# EAGLE design Stromcek v1.0 (EAGLE 9.6.2)
CNAME: Solder paste dispenser; DESIGNER: Miroslav Pivovarsky
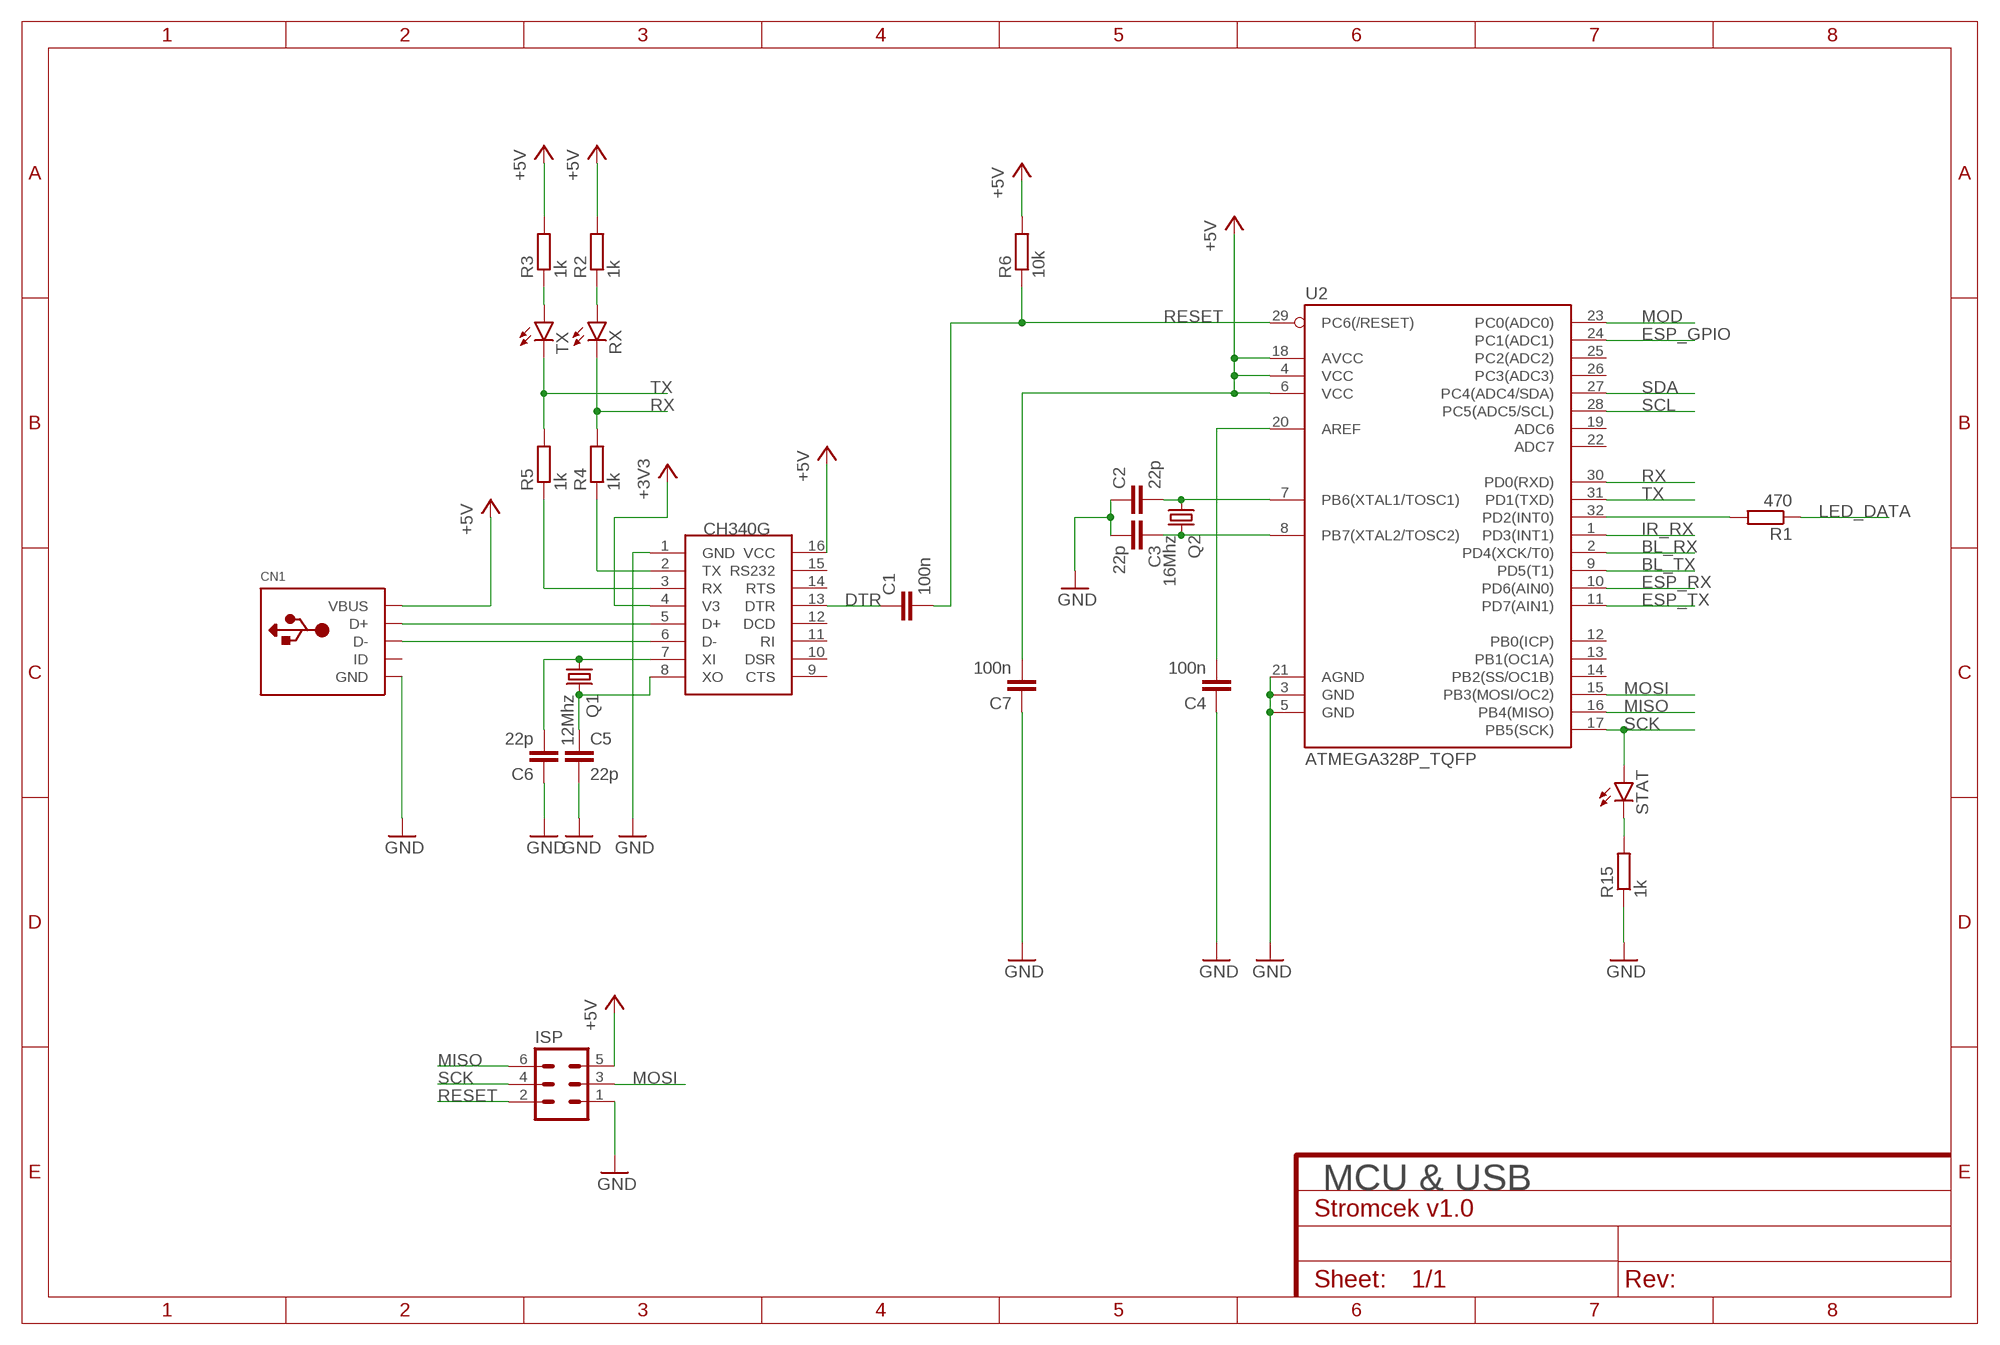
[diagram p0: schematic, sheet 1, part 1 of 2]
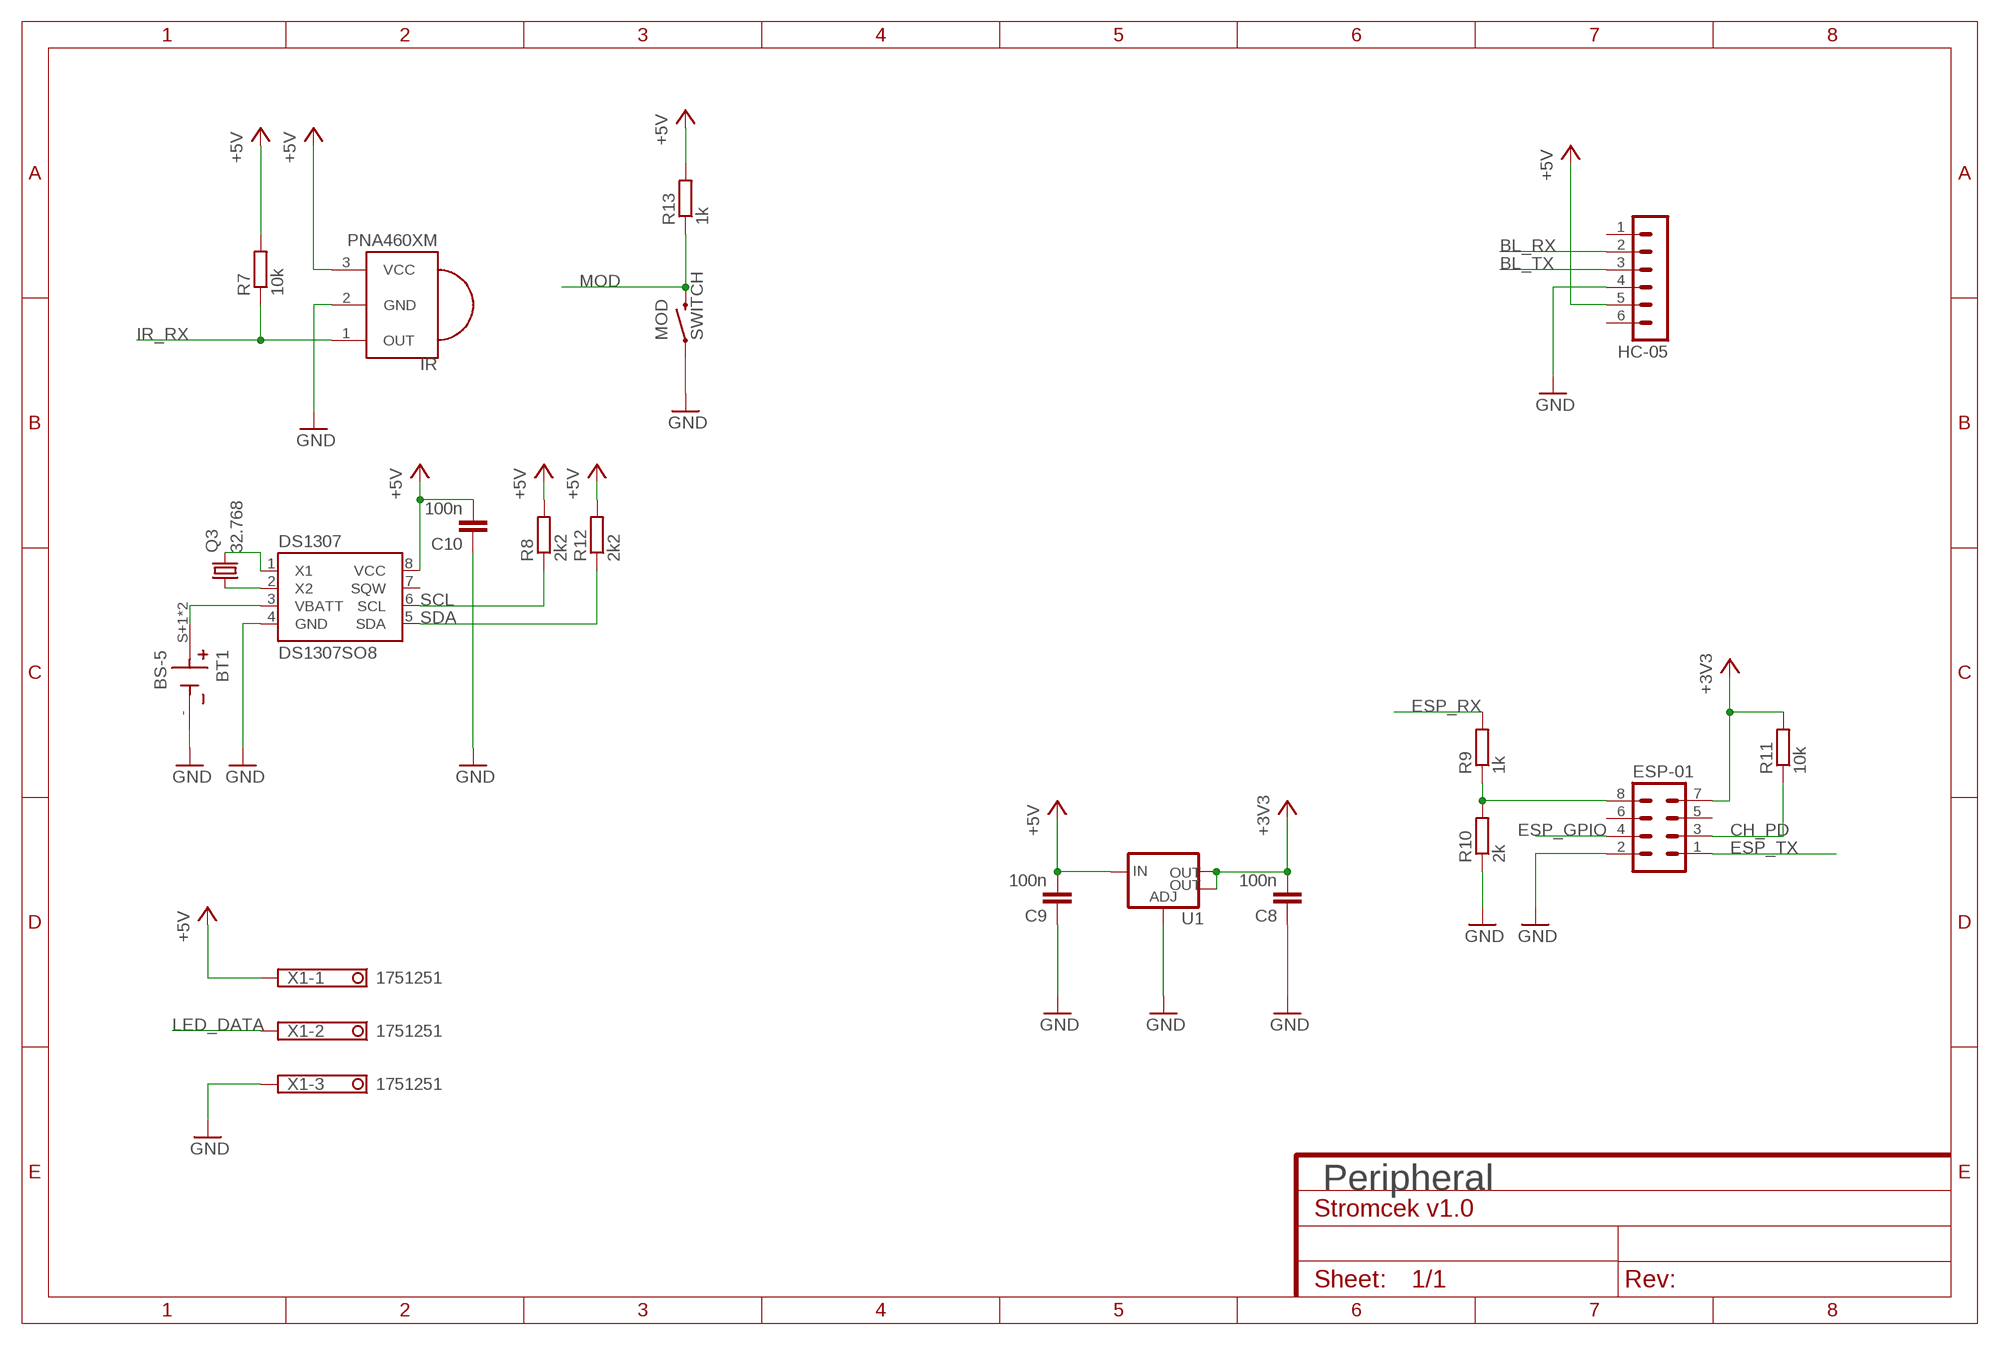
[diagram p1: schematic, sheet 1, part 2 of 2]

## Parts
BT1  BS-5  [BAT_BS-5]
C1  100n  C-EUC0603  [C0603]
C2  22p  C-EUC0603  [C0603]
C3  22p  C-EUC0603  [C0603]
C4  100n  C-EUC0603  [C0603]
C5  22p  C-EUC0603  [C0603]
C6  22p  C-EUC0603  [C0603]
C7  100n  C-EUC0603  [C0603]
C8  100n  C-EUC0603  [C0603]
C9  100n  C-EUC0603  [C0603]
C10  100n  C-EUC0603  [C0603]
CN1  USBMOLEX  [USB-MINIB-THM-MOLEX]
DS1307  DS1307SO8  [SO08]
ESP-01  MA04-2  [MA04-2]
HC-05  MA06-1  [MA06-1]
IR  PNA460XM  [PNA460XM]
ISP  MA03-2  [MA03-2]
MOD  SWITCH  SWITCH-MOMENTARY-2PTH_EZ  [TACTILE-PTH-EZ]
Q1  12Mhz  CRYSTALHC49UP  [HC49UP]
Q2  16Mhz  CRYSTALHC49UP  [HC49UP]
Q3  32.768  CRYSTALTC26  [TC26]
R1  470  R-EU_R0603  [R0603]
R2  1k  R-EU_R0603  [R0603]
R3  1k  R-EU_R0603  [R0603]
R4  1k  R-EU_R0603  [R0603]
R5  1k  R-EU_R0603  [R0603]
R6  10k  R-EU_R0603  [R0603]
R7  10k  R-EU_R0603  [R0603]
R8  2k2  R-EU_R0603  [R0603]
R9  1k  R-EU_R0603  [R0603]
R10  2k  R-EU_R0603  [R0603]
R11  10k  R-EU_R0603  [R0603]
R12  2k2  R-EU_R0603  [R0603]
R13  1k  R-EU_R0603  [R0603]
R15  1k  R-EU_R0603  [R0603]
RX  LEDSML0805  [SML0805]
STAT  LEDSML0805  [SML0805]
TX  LEDSML0805  [SML0805]
U1  V_REG_LM1117SOT223  [SOT223]
U2  ATMEGA328P_TQFP  [TQFP32-08]
U$1  CH340G  [SOIC16]
X1  1751251  [1751251]

## Nets
+3V3: C8.2 ESP-01.7 R11.2 U1.2(OUT) U1.4(OUT) U$1.4(V3)
+5V: C7.2 C9.2 C10.2 CN1.VBUS DS1307.8(VCC) HC-05.5 IR.3(VCC) ISP.5 R2.2 R3.2 R6.2 R7.2 R8.2 R12.2 R13.2 U1.3(IN) U2.4(VCC) U2.6(VCC) U2.18(AVCC) U$1.16(VCC) X1.1
BL_RX: HC-05.2 U2.2(PD4(XCK/T0))
BL_TX: HC-05.3 U2.9(PD5(T1))
CH_PD: ESP-01.3 R11.1
DTR: C1.1 U$1.13(DTR)
ESP_GPIO: ESP-01.4 U2.24(PC1(ADC1))
ESP_RX: R9.2 U2.10(PD6(AIN0))
ESP_RX_: ESP-01.8 R9.1 R10.2
ESP_TX: ESP-01.1 U2.11(PD7(AIN1))
GND: BT1.- C2.1 C3.2 C4.1 C5.2 C6.1 C7.1 C8.1 C9.1 C10.1 CN1.GND CN1.GND1(GND) CN1.GND4(GND) DS1307.4(GND) ESP-01.2 HC-05.4 IR.2(GND) ISP.1 MOD.1 R10.1 R15.1 U1.1(ADJ) U2.3(GND) U2.5(GND) U2.21(AGND) U$1.1(GND) X1.3
IR_RX: IR.1(OUT) R7.1 U2.1(PD3(INT1))
LED_DATA: R1.1 X1.2
MISO: ISP.6 U2.16(PB4(MISO))
MOD: MOD.3 R13.1 U2.23(PC0(ADC0))
MOSI: ISP.3 U2.15(PB3(MOSI/OC2))
N$1: CN1.D+ U$1.5(D+)
N$2: R1.2 U2.32(PD2(INT0))
N$3: CN1.D- U$1.6(D-)
N$4: R5.1 U$1.3(RX)
N$5: R4.1 U$1.2(TX)
N$6: C2.2 Q2.1 U2.7(PB6(XTAL1/TOSC1))
N$7: C6.2 Q1.1 U$1.7(XI)
N$8: C5.1 Q1.2 U$1.8(XO)
N$9: R2.1 RX.A
N$10: R3.1 TX.A
N$11: C3.1 Q2.2 U2.8(PB7(XTAL2/TOSC2))
N$12: C4.2 U2.20(AREF)
N$16: R15.2 STAT.C
N$268: BT1.S+1(+) BT1.S+2(+) DS1307.3(VBATT)
N$269: DS1307.2(X2) Q3.1
N$270: DS1307.1(X1) Q3.2
RESET: C1.2 ISP.2 R6.1 U2.29(PC6(/RESET))
RX: R4.2 RX.C U2.30(PD0(RXD))
SCK: ISP.4 STAT.A U2.17(PB5(SCK))
SCL: DS1307.6(SCL) R8.1 U2.28(PC5(ADC5/SCL))
SDA: DS1307.5(SDA) R12.1 U2.27(PC4(ADC4/SDA))
TX: R5.2 TX.C U2.31(PD1(TXD))
Unconnected: CN1.ID DS1307.7(SQW) ESP-01.5 ESP-01.6 HC-05.1 HC-05.6 U2.12(PB0(ICP)) U2.13(PB1(OC1A)) U2.14(PB2(SS/OC1B)) U2.19(ADC6) U2.22(ADC7) U2.25(PC2(ADC2)) U2.26(PC3(ADC3)) U$1.9(CTS) U$1.10(DSR) U$1.11(RI) U$1.12(DCD) U$1.14(RTS) U$1.15(RS232)

## Notes on the sheet
- Peripheral
- MCU & USB

## Library data of the parts
BT1 = BS-5:BS-5: BATTERY HOLDER COIN 20MM PC PIN; AVAILABILITY: Unavailable; DESCRIPTION: BATTERY HOLDER COIN 20MM PC PIN; MF: MPD; MP: BS-5; PACKAGE: MSOP-12 MPD; PRICE: None
C1-C10 = rcl:C-EU: CAPACITOR, European symbol; SPICEPREFIX: C
CN1 = adafruit:USB: USB Connectors USBMINIB - Surface Mount Female Mini-B USB Connector 4UConnector: 06564 By microbuilder.eu Thru-hole RA Female Mini-B USB Connector 4UConnector: 18732 By ladyada.net
DS1307 = SparkFun:DS1307
ESP-01 = con-lstb:MA04-2: PIN HEADER; OC_FARNELL: unknown; OC_NEWARK: unknown
HC-05 = con-lstb:MA06-1: PIN HEADER; OC_FARNELL: unknown; OC_NEWARK: unknown
IR = adafruit:PNA460XM: IR 38KHz receiver PNA4602 and related receivers http://www.ladyada.net/library/pcb/eaglelibrary.html
ISP = con-lstb:MA03-2: PIN HEADER; OC_FARNELL: unknown; OC_NEWARK: unknown
MOD = SparkFun-Electromechanical:SWITCH-MOMENTARY-2: Various NO switches- pushbuttons, reed, etc
Q1 Q2 = adafruit:CRYSTAL: CRYSTAL; OC_FARNELL: unknown; OC_NEWARK: unknown
Q3 = 23K_candrian:CRYSTAL
R1-R12 R15 = rcl:R-EU_: RESISTOR, European symbol; SPICEPREFIX: R
R13 = resistor:R-EU_: RESISTOR, European symbol
RX STAT TX = led:LED: LED OSRAM: - CHIPLED LG R971, LG N971, LY N971, LG Q971, LY Q971, LO R971, LY R971 LH N974, LH R974 LS Q976, LO Q976, LY Q976 LO Q996 - Hyper CHIPLED LW Q18S LB Q993, LB Q99A, LB R99A - SideLED LS A670, LO A670, LY A670, LG A670, LP A670 LB A673, LV A673, LT A673, LW A673 LH A674 LY A675 LS A676, LA A676, LO A676, LY A676, LW A676 LS A679, LY A679, LG A679 - Hyper Micro SIDELED® LS Y876, LA Y876, LO Y876, LY Y876 LT Y87S - SmartLED LW L88C, LW L88S LB L89C, LB L89S, LG L890 LS L89K, LO L89K, LY L89K LS L896, LA L896, LO L896, LY L896 - TOPLED LS T670, LO T670, LY T670, LG T670, LP T670 LSG T670, LSP T670, LSY T670, LOP T670, LYG T670 LG T671, LOG T671, LSG T671 LB T673, LV T673, LT T673, LW T673 LH T674 LS T676, LA T676, LO T676, LY T676, LB T676, LH T676, LSB T676, LW T676 LB T67C, LV T67C, LT T67C, LS T67K, LO T67K, LY T67K, LW E67C LS E67B, LA E67B, LO E67B, LY E67B, LB E67C, LV E67C, LT E67C LW T67C LS T679, LY T679, LG T679 LS T770, LO T770, LY T770, LG T770, LP T770 LB T773, LV T773, LT T773, LW T773 LH T774 LS E675, LA E675, LY E675, LS T675 LS T776, LA T776, LO T776, LY T776, LB T776 LHGB T686 LT T68C, LB T68C - Hyper Mini TOPLED® LB M676 - Mini TOPLED Santana® LG M470 LS M47K, LO M47K, LY M47K Source: http://www.osram.convergy.de LUXEON: - LUMILED® LXK2-PW12-R00, LXK2-PW12-S00, LXK2-PW14-U00, LXK2-PW14-V00 LXK2-PM12-R00, LXK2-PM12-S00, LXK2-PM14-U00 LXK2-PE12-Q00, LXK2-PE12-R00, LXK2-PE12-S00, LXK2-PE14-T00, LXK2-PE14-U00 LXK2-PB12-K00, LXK2-PB12-L00, LXK2-PB12-M00, LXK2-PB14-N00, LXK2-PB14-P00, LXK2-PB14-Q00 LXK2-PR12-L00, LXK2-PR12-M00, LXK2-PR14-Q00, LXK2-PR14-R00 LXK2-PD12-Q00, LXK2-PD12-R00, LXK2-PD12-S00 LXK2-PH12-R00, LXK2-PH12-S00 LXK2-PL12-P00, LXK2-PL12-Q00, LXK2-PL12-R00 Source: www.luxeon.com KINGBRIGHT: KA-3528ASYC Source: www.kingbright.com
U1 = SparkFun-IC-Power:V_REG_LM1117: Voltage Regulator LM1117 Standard adjustable voltage regulator but in SMD form. Spark Fun Electronics SKU : COM-00595; PROD_ID: VREG-08170
U2 = SparkFun-DigitalIC:ATMEGA328P_TQFP; PROD_ID: IC-09069
U$1 = ch340g:CH340G
X1 = con-phoenix-350:1751251: MKDS 1/ 3-3,5 Printklemme Nennstrom: 10 A Bemessungsspannung: 160 V Raster: 3,5 mm Polzahl: 3 Montageart: Löten Anschlussart: Schraubanschluss Anschlussrichtung vom Leiter zur Platine: 0° Source: http://eshop.phoenixcontact.com .. 1751251.pdf; OC_FARNELL: unknown; OC_NEWARK: unknown

## Board
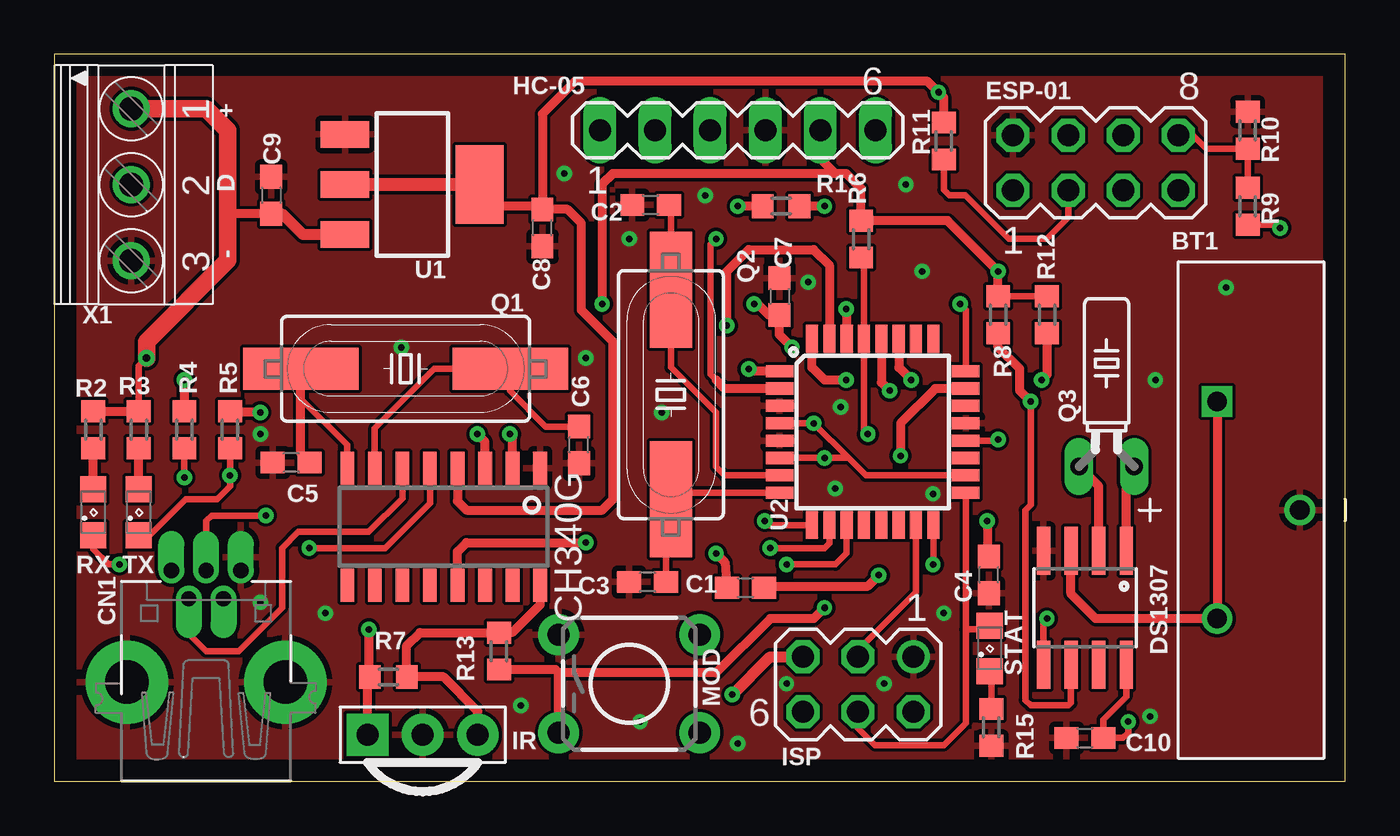
[diagram p2: board, top side]
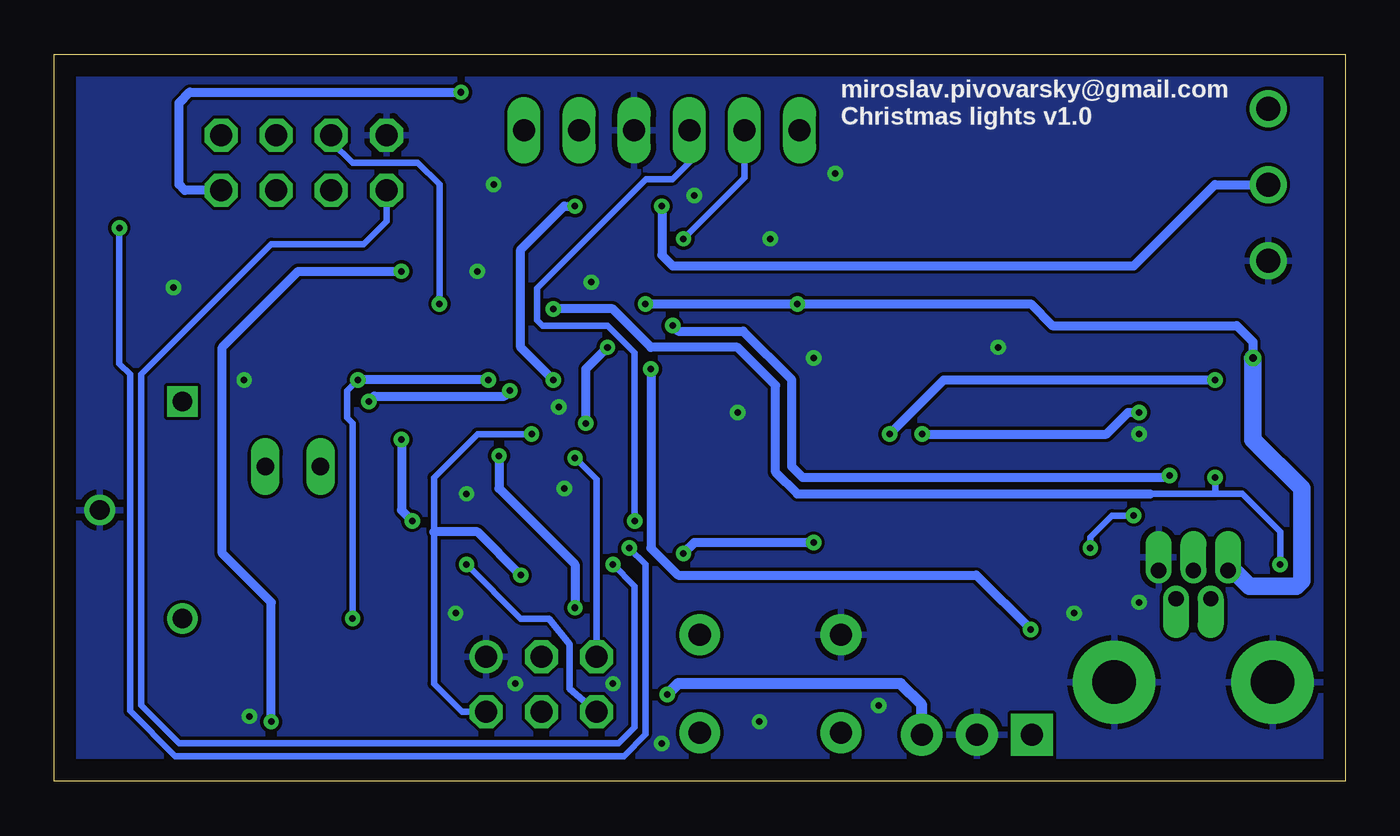
[diagram p3: board, bottom side, seen from below]

Size 59.5 x 33.5 mm. Coordinates in mm from the lower left corner, seen from the top.
Outline: 0,0 59.5,0 59.5,33.5 0,33.5 0,0
Copper layers (1*16): Top 0.035mm / dielectric 1.5mm / Bottom 0.035mm
Design rules "default *": minimum track width 6mil, minimum drill 0.35mm, track to track 6mil, track to pad 6mil, pad to pad 6mil, via to via 6mil, smd to smd 6mil, copper to edge 40mil, drill to drill 6mil, minimum pad ring 10mil, minimum via ring 8mil, stop-mask expansion 4mil, vias tented up to drill 20mil, thermal gap 10mil

### Footprints (pad centres in the part's own frame; a part is rotated, then mirrored left to right if it is on the bottom)
BAT_BS-5 = drill 0.9 pad 1.35: - 1.905,0; S+2 -1.905,-5 | drill 0.9 pad 1.35 square: S+1 -1.905,5
C0603 = smd 1.1 x 1: 1 -0.85,0; 2 0.85,0
USB-MINIB-THM-MOLEX = drill 0.7 offset: D+ 0,9.72; D- -0.8,8.42; GND 1.6,9.72; ID 0.8,8.42; VBUS -1.6,9.72 | drill 2 pad 3.81: GND1 -3.65,4.57; GND4 3.65,4.57
SO08 = smd 0.61 x 2.21: 1 -1.905,-2.616; 2 -0.635,-2.616; 3 0.635,-2.616; 4 1.905,-2.616; 5 1.905,2.616; 6 0.635,2.616; 7 -0.635,2.616; 8 -1.905,2.616
MA04-2 = drill 1.016 octagon: 1 -3.81,-1.27; 2 -3.81,1.27; 3 -1.27,-1.27; 4 -1.27,1.27; 5 1.27,-1.27; 6 1.27,1.27; 7 3.81,-1.27; 8 3.81,1.27
MA06-1 = drill 1.016 long: 1 -6.35,0; 2 -3.81,0; 3 -1.27,0; 4 1.27,0; 5 3.81,0; 6 6.35,0
PNA460XM = drill 1.016 pad 1.93 square: 1 -2.54,0 | drill 1.016 pad 1.93: 2 0,0; 3 2.54,0
MA03-2 = drill 1.016: 1 -2.54,-1.27 | drill 1.016 octagon: 2 -2.54,1.27; 3 0,-1.27; 4 0,1.27; 5 2.54,-1.27; 6 2.54,1.27
TACTILE-PTH-EZ = drill 1.016 pad 1.88: 1 -3.251,2.261; 2 3.251,2.261; 3 -3.251,-2.261; 4 3.251,-2.261
HC49UP = smd 5.334 x 1.93: 1 -4.826,0; 2 4.826,0
TC26 = drill 0.8 pad 1.27 long: 1 -1.27,-2; 2 1.27,-2
R0603 = smd 1 x 1.1: 1 -0.85,0; 2 0.85,0
SML0805 = smd 1.2 x 1.2: A 1.05,0; C -1.05,0
SOT223 = smd 1.219 x 2.235: 1 -2.311,-3.099; 2 0,-3.099; 3 2.311,-3.099 | smd 3.6 x 2.2: 4 0,3.099
TQFP32-08 = smd 1.27 x 0.559: 1 -4.293,2.8; 2 -4.293,2; 3 -4.293,1.2; 4 -4.293,0.4; 5 -4.293,-0.4; 6 -4.293,-1.2; 7 -4.293,-2; 8 -4.293,-2.8; 17 4.293,-2.8; 18 4.293,-2; 19 4.293,-1.2; 20 4.293,-0.4; 21 4.293,0.4; 22 4.293,1.2; 23 4.293,2; 24 4.293,2.8 | smd 0.559 x 1.27: 9 -2.8,-4.293; 10 -2,-4.293; 11 -1.2,-4.293; 12 -0.4,-4.293; 13 0.4,-4.293; 14 1.2,-4.293; 15 2,-4.293; 16 2.8,-4.293; 25 2.8,4.293; 26 2,4.293; 27 1.2,4.293; 28 0.4,4.293; 29 -0.4,4.293; 30 -1.2,4.293; 31 -2,4.293; 32 -2.8,4.293
SOIC16 = smd 0.635 x 1.524: 1 -4.445,-2.695; 2 -3.175,-2.695; 3 -1.905,-2.695; 4 -0.635,-2.695; 5 0.635,-2.695; 6 1.905,-2.695; 7 3.175,-2.695; 8 4.445,-2.695; 9 4.445,2.695; 10 3.175,2.695; 11 1.905,2.695; 12 0.635,2.695; 13 -0.635,2.695; 14 -1.905,2.695; 15 -3.175,2.695; 16 -4.445,2.695
1751251 = drill 1.1 pad 1.7: 1 -3.5,-0.1; 2 0,-0.1; 3 3.5,-0.1

### Placement (x,y rotation side)
BT1  55.5,12.5 0 top
C1  31.86,8.92 0 top
C2  27.49,26.56 0 top
C3  27.34,9.19 180 top
C4  43.08,9.51 90 top
C5  10.92,14.69 180 top
C6  24.19,15.5 90 top
C7  33.42,22.34 270 top
C8  22.5,25.5 90 top
C9  10,27 270 top
C10  47.5,2 0 top
CN1  7,0 0 top
DS1307  47.5,8 180 top
ESP-01  48,28.5 0 top
HC-05  31.5,30 0 top
IR  16.98,2.15 0 top
ISP  37.05,4.47 180 top
MOD  26.5,4.5 0 top
Q1  16.19,19.01 180 top
Q2  28.42,17.82 270 top
Q3  48.5,16.5 0 top
R1  33.5,26.5 0 top
R2  1.8,16.2 90 top
R3  3.9,16.2 90 top
R4  6,16.2 270 top
R5  8.1,16.2 270 top
R6  37.19,24.98 90 top
R7  15.4,4.81 0 top
R8  43.5,21.5 90 top
R9  55,26.5 270 top
R10  55,30 270 top
R11  41,29.5 90 top
R12  45.75,21.5 90 top
R13  20.5,6 90 top
R15  43.19,2.49 90 top
RX  1.8,12.4 90 top
STAT  43.11,6.13 90 top
TX  3.9,12.4 90 top
U1  16.5,27.5 270 top
U2  37.72,16.1 0 top
U$1  17.95,11.74 180 top
X1  3.65,27.49 270 top

### Tracks (layer width: path | path; a pad name or v marks a point on that pad's centre or on a via)
+3V3  (via drill 0.3)
  Top 0.406: R11.2 41,31.5 v40.75,31.75 40.25,32.25 24,32.25 22.5,30.75 C8.2 | U$1.4 18.59,12.91 19,12.5 25.25,12.5 25.75,13 25.75,20.25 24.29,21.71 24.29,25.71 23.65,26.35 C8.2 | C8.2 22.35,26.5 20,26.5 19.6,26.9 U1.4
  Top 0.61: U1.2 U1.4
  Bottom 0.406: ESP-01.7 53.48,27.23 53.75,27.5 53.75,31.25 53.25,31.75 v40.75,31.75
+5V  (via drill 0.3, 0.35)
  Top 0.305: U2.4 v35,16.5 36.6,14.9 | U2.18 37.4,14.1 36.6,14.9 | U2.6 v35.5,14.9 36.6,14.9 | R3.2 3.9,19.15 v4.25,19.5 | R12.2 R8.2 | v49.5,2.75 49.5,2.25 49.25,2 C10.2 48.35,2.85 49.41,3.9 DS1307.8
  Top 0.406: R2.2 R3.2 | v34,20 33.42,20.58 C7.2 32.92,21.49 32.41,22 v32.25,22 | U$1.16 22.39,8.14 21.1,6.85 R13.2 16.85,6.85 16.25,6.25 R7.2 17.94,4.81 19.52,3.23 IR.3 | 36,28 36.5,28 37.19,27.31 R6.2 41.17,25.83 v43.5,23.5 R8.2 | 36,28 35.31,28.69 HC-05.5 | 36,28 25.75,28 25.25,27.5 v25.25,22 | C9.2 8.1,26.15 8,26.25
  Top 0.508: U1.3 11.46,25.19 10.5,26.15 C9.2 | v31.25,4 32.99,5.74 ISP.5
  Top 0.813: X1.1 7.01,30.99 8,30 8,26.25 8,24 4.25,20.25 v4.25,19.5
  Bottom 0.305: ISP.5 34.51,13.91 v35.5,14.9
  Bottom 0.406: v34,20 35,19 v35,16.5 | v32.25,22 v25.25,22 14.5,22 13.5,21 5,21 4.25,20.25 v4.25,19.5 | v49.5,2.75 49.5,8.25 51.75,10.5 51.75,20 48.25,23.5 v43.5,23.5
  Bottom 0.508: IR.3 19.52,3.52 20.5,4.5 30.75,4.5 v31.25,4
  Bottom 0.813: CN1.VBUS 5.15,9.72 4.43,9 2.25,9 2,9.25 2,13.5 4.25,15.75 v4.25,19.5
BL_RX  (via drill 0.3)
  Top 0.305: 30.5,18.5 30.25,18.75 30.25,24.75 v30.5,25
  Top 0.406: U2.2 30.9,18.1 30.5,18.5
  Bottom 0.305: v30.5,25 27.69,27.81 HC-05.2
BL_TX  (via drill 0.3)
  Top 0.305: U2.9 32.94,11.81 v32.75,12
  Bottom 0.305: v32.75,12 32.75,19.75 34,21 37,21 37.25,21.25 37.25,22.73 32.23,27.75 31,27.75 30.23,28.52 HC-05.3
CH_PD
  Top 0.305: R11.1 41,27.25 41.25,27 42,27 44,25 45.75,25 46.73,25.98 ESP-01.3
DTR  (via drill 0.3)
  Top 0.406: U$1.13 18.59,10.59 19,11 v24.5,11 | v30.5,10.5 30.91,10.09 C1.1
  Bottom 0.406: v24.5,11 30,11 v30.5,10.5
ESP_GPIO  (via drill 0.3)
  Top 0.305: U2.24 42.01,21.74 v41.75,22
  Bottom 0.305: ESP-01.4 46.73,29.48 45.75,28.5 42.75,28.5 41.75,27.5 v41.75,22
ESP_RX  (via drill 0.3)
  Top 0.305: U2.10 35.72,10.97 35.5,10.75 v33,10.75 | R9.2 56.35,25.65 v56.5,25.5
  Bottom 0.305: v33,10.75 32.25,10 32.25,2.17 33.25,1.17 53.92,1.17 56,3.25 56,18.75 56.5,19.25 v56.5,25.5
ESP_RX_
  Top 0.305: R9.1 R10.2 53.1,29.15 52.5,29.75 51.83,29.75 ESP-01.8
ESP_TX  (via drill 0.3)
  Top 0.305: U2.11 36.52,10.52 36,10 v33.75,10
  Bottom 0.305: v33.75,10 32.75,9 32.75,2.5 33.5,1.75 53.75,1.75 55.5,3.5 55.5,18.75 49.5,24.75 45.25,24.75 44.19,25.81 ESP-01.1
GND  (via drill 0.3)
  other vias: 12.5,7.75 9.5,16 24.5,19.5 36,13.5 16,20 28,17 27,2.75 38.25,4.5 40.5,13.25 50.5,3 50.75,18.5 54,22.75 40,23.5 30,27 34.75,23 36.25,17.25 21.5,3.5 9.5,8.25 23.5,28 26.5,25 39.25,27.5 31.5,1.75 33.75,4.5 41,7.75
  pour Top: 0,33.5 59.5,33.5 59.5,0 0,0
  pour Bottom: 0,33.5 59.5,33.5 59.5,0 0,0
IR_RX  (via drill 0.3)
  Top 0.406: U2.1 32.1,18.9 v32,19 | v14.5,7 14.5,4.86 | 14.5,4.86 R7.1 | IR.1 14.44,4.8 14.5,4.86
  Bottom 0.406: v32,19 32,10.75 30.75,9.5 17,9.5 v14.5,7
LED_DATA  (via drill 0.3)
  Top 0.406: R1.1 v31.5,26.5
  Bottom 0.406: v31.5,26.5 31.5,24.25 31,23.75 9.75,23.75 6.01,27.49 X1.2
MISO  (via drill 0.3)
  Top 0.305: U2.16 40.52,10.02 v40.5,10
  Bottom 0.305: v40.5,10 38,7.5 36.7,7.5 35.75,6.33 35.75,4.27 ISP.6
MOD  (via drill 0.3)
  Top 0.406: MOD.3 23.25,5 | U2.23 40.6,18.1 39,16.5 v39,15 | v35.5,8 35,7.5 33,7.5 30.5,5 23.25,5 | 23.25,5 23.1,5.15 R13.1
  Bottom 0.406: v39,15 39,13.5 35.5,10 v35.5,8
MOSI
  Top 0.305: U2.15 39.72,8.72 37.05,6.05 ISP.3
N$1  (via drill 0.3)
  Top 0.305: U$1.5 17.32,12.81 15.25,10.75 v11.75,10.75 | CN1.D+ 7,12 7.25,12.25 v9.75,12.25
  Bottom 0.305: v11.75,10.75 11.75,11.25 10.75,12.25 v9.75,12.25
N$2  (via drill 0.3)
  Top 0.406: U2.32 34.92,19.08 35.5,18.5 v36.5,18.5 | v35.5,26.5 R1.2
  Bottom 0.406: v36.5,18.5 38,20 38,24.5 36,26.5 v35.5,26.5
N$3
  Top 0.305: U$1.6 16.05,13.04 14.5,11.5 11.25,11.5 10.5,10.75 10.5,8 8.5,6 7,6 6.2,6.8 CN1.D-
N$4  (via drill 0.3)
  Top 0.406: U$1.3 19.86,15.64 v19.5,16 | v9.5,17 8.15,17 R5.1
  Bottom 0.406: v19.5,16 11,16 10,17 v9.5,17
N$5  (via drill 0.3)
  Top 0.406: U$1.2 21.12,15.88 v21,16 | v6,18.5 R4.1
  Bottom 0.406: v21,16 18.5,18.5 v6,18.5
N$6
  Top 0.305: U2.7 30.9,14.1 30.5,14.5 30.5,17 28.42,19.08 Q2.1 28.42,26.58 C2.2
N$7
  Top 0.305: U$1.7 14.78,16.27 17.51,19.01 21,19.01 | 21,19.01 Q1.1 | C6.2 22.65,16.35 21,18 21,19.01
N$8
  Top 0.305: U$1.8 13.5,15.5 11.36,17.64 Q1.2
  Top 0.406: C5.1 11.36,15.1 Q1.2
N$9
  Top 0.406: RX.A R2.1
N$10
  Top 0.406: TX.A R3.1
N$11
  Top 0.305: U2.8 28.73,13.3 Q2.2 | 28.19,12.76 C3.1
  Top 0.406: Q2.2 28.19,12.76
N$12  (via drill 0.3)
  Top 0.305: U2.20 43.45,15.7 v43.5,15.75
  Top 0.406: v43,12 43,10.44 C4.2
  Bottom 0.406: v43.5,15.75 43.5,12.5 v43,12
N$16
  Top 0.305: R15.2 43.19,5 STAT.C
N$268
  Top 0.406: BT1.S+1 BT1.S+2 48,7.5 46.87,8.63 DS1307.3
N$269
  Top 0.406: DS1307.2 48.13,13.6 Q3.1
N$270
  Top 0.406: DS1307.1 49.41,14.13 Q3.2
RESET  (via drill 0.3)
  Top 0.305: v37.5,16 37.32,16.18 U2.29 37.32,24 R6.1
  Top 0.406: C1.2 32.89,9 37.5,9 v38,9.5
  Bottom 0.305: v37.5,16 40,16 42,14 42,11.5 42,4.5 40.7,3.2 ISP.2
  Bottom 0.406: v38,9.5 40,11.5 42,11.5
RX  (via drill 0.3)
  Top 0.305: R4.2 v6,14 | v3,10 2.5,10 1.8,10.7 RX.C
  Top 0.406: v36.5,21.77 36.52,21.75 U2.30
  Bottom 0.305: v3,10 3,11.5 4.75,13.25 6,13.25 | v6,14 6,13.25 | 9,13.25 6,13.25
  Bottom 0.406: 9,13.25 25.25,13.25 26.25,14.25 26.25,18.25 28,20 32,20 33.77,21.77 v36.5,21.77
SCK
  Top 0.305: U2.17 42.01,7 | 42.01,7 42.01,2.68 41,1.67 37.83,1.67 37.05,2.45 ISP.4 | 42.01,7 42.93,7 STAT.A
SCL  (via drill 0.3)
  Top 0.305: v45,17.5 45,12.75 44.75,12.5 44.75,3.75 45,3.5 46.75,3.5 46.87,3.62 DS1307.6
  Top 0.406: U2.28 38.12,18.38 v38.5,18 | v45,17.5 44.5,18 44.5,19 43.5,20 R8.1
  Bottom 0.406: v38.5,18 38.75,17.75 44.75,17.75 v45,17.5
SDA  (via drill 0.3)
  Top 0.305: DS1307.5 45.59,7.34 v45.75,7.5
  Top 0.406: U2.27 38.92,19.08 v39.5,18.5 | v45.5,18.5 45.75,18.75 R12.1
  Bottom 0.305: v45.5,18.5 46,18 46,16.75 45.75,16.5 v45.75,7.5
  Bottom 0.406: v39.5,18.5 v45.5,18.5
TX  (via drill 0.3)
  Top 0.305: R5.2 v8.1,14.1 8.1,13.6 7.5,13 6.05,13 4.4,11.35 TX.C
  Top 0.406: U2.31 35.72,23.78 35,24.5 32,24.5 31,23.5 v31,21
  Bottom 0.406: v8.1,14.1 8.2,14 25,14 25.5,14.5 25.5,18.5 27.75,20.75 30.75,20.75 v31,21

### Text on the board
tNames: + | D | -
bNames: miroslav.pivovarsky@gmail.com | Christmas lights v1.0